# EasyEDA Pro project medulla_2026-05-03.epro

# Schematic Schematic1
Board Name: Board1; Create Date: 2025-12-13; Page Name: P1; Project Name: Kart Medulla (expander for ESP 32); Schematic Name: Schematic1; Update Date: 2026-05-03; Company: EasyEDA.com; Page Size: A4; Version: V1.0
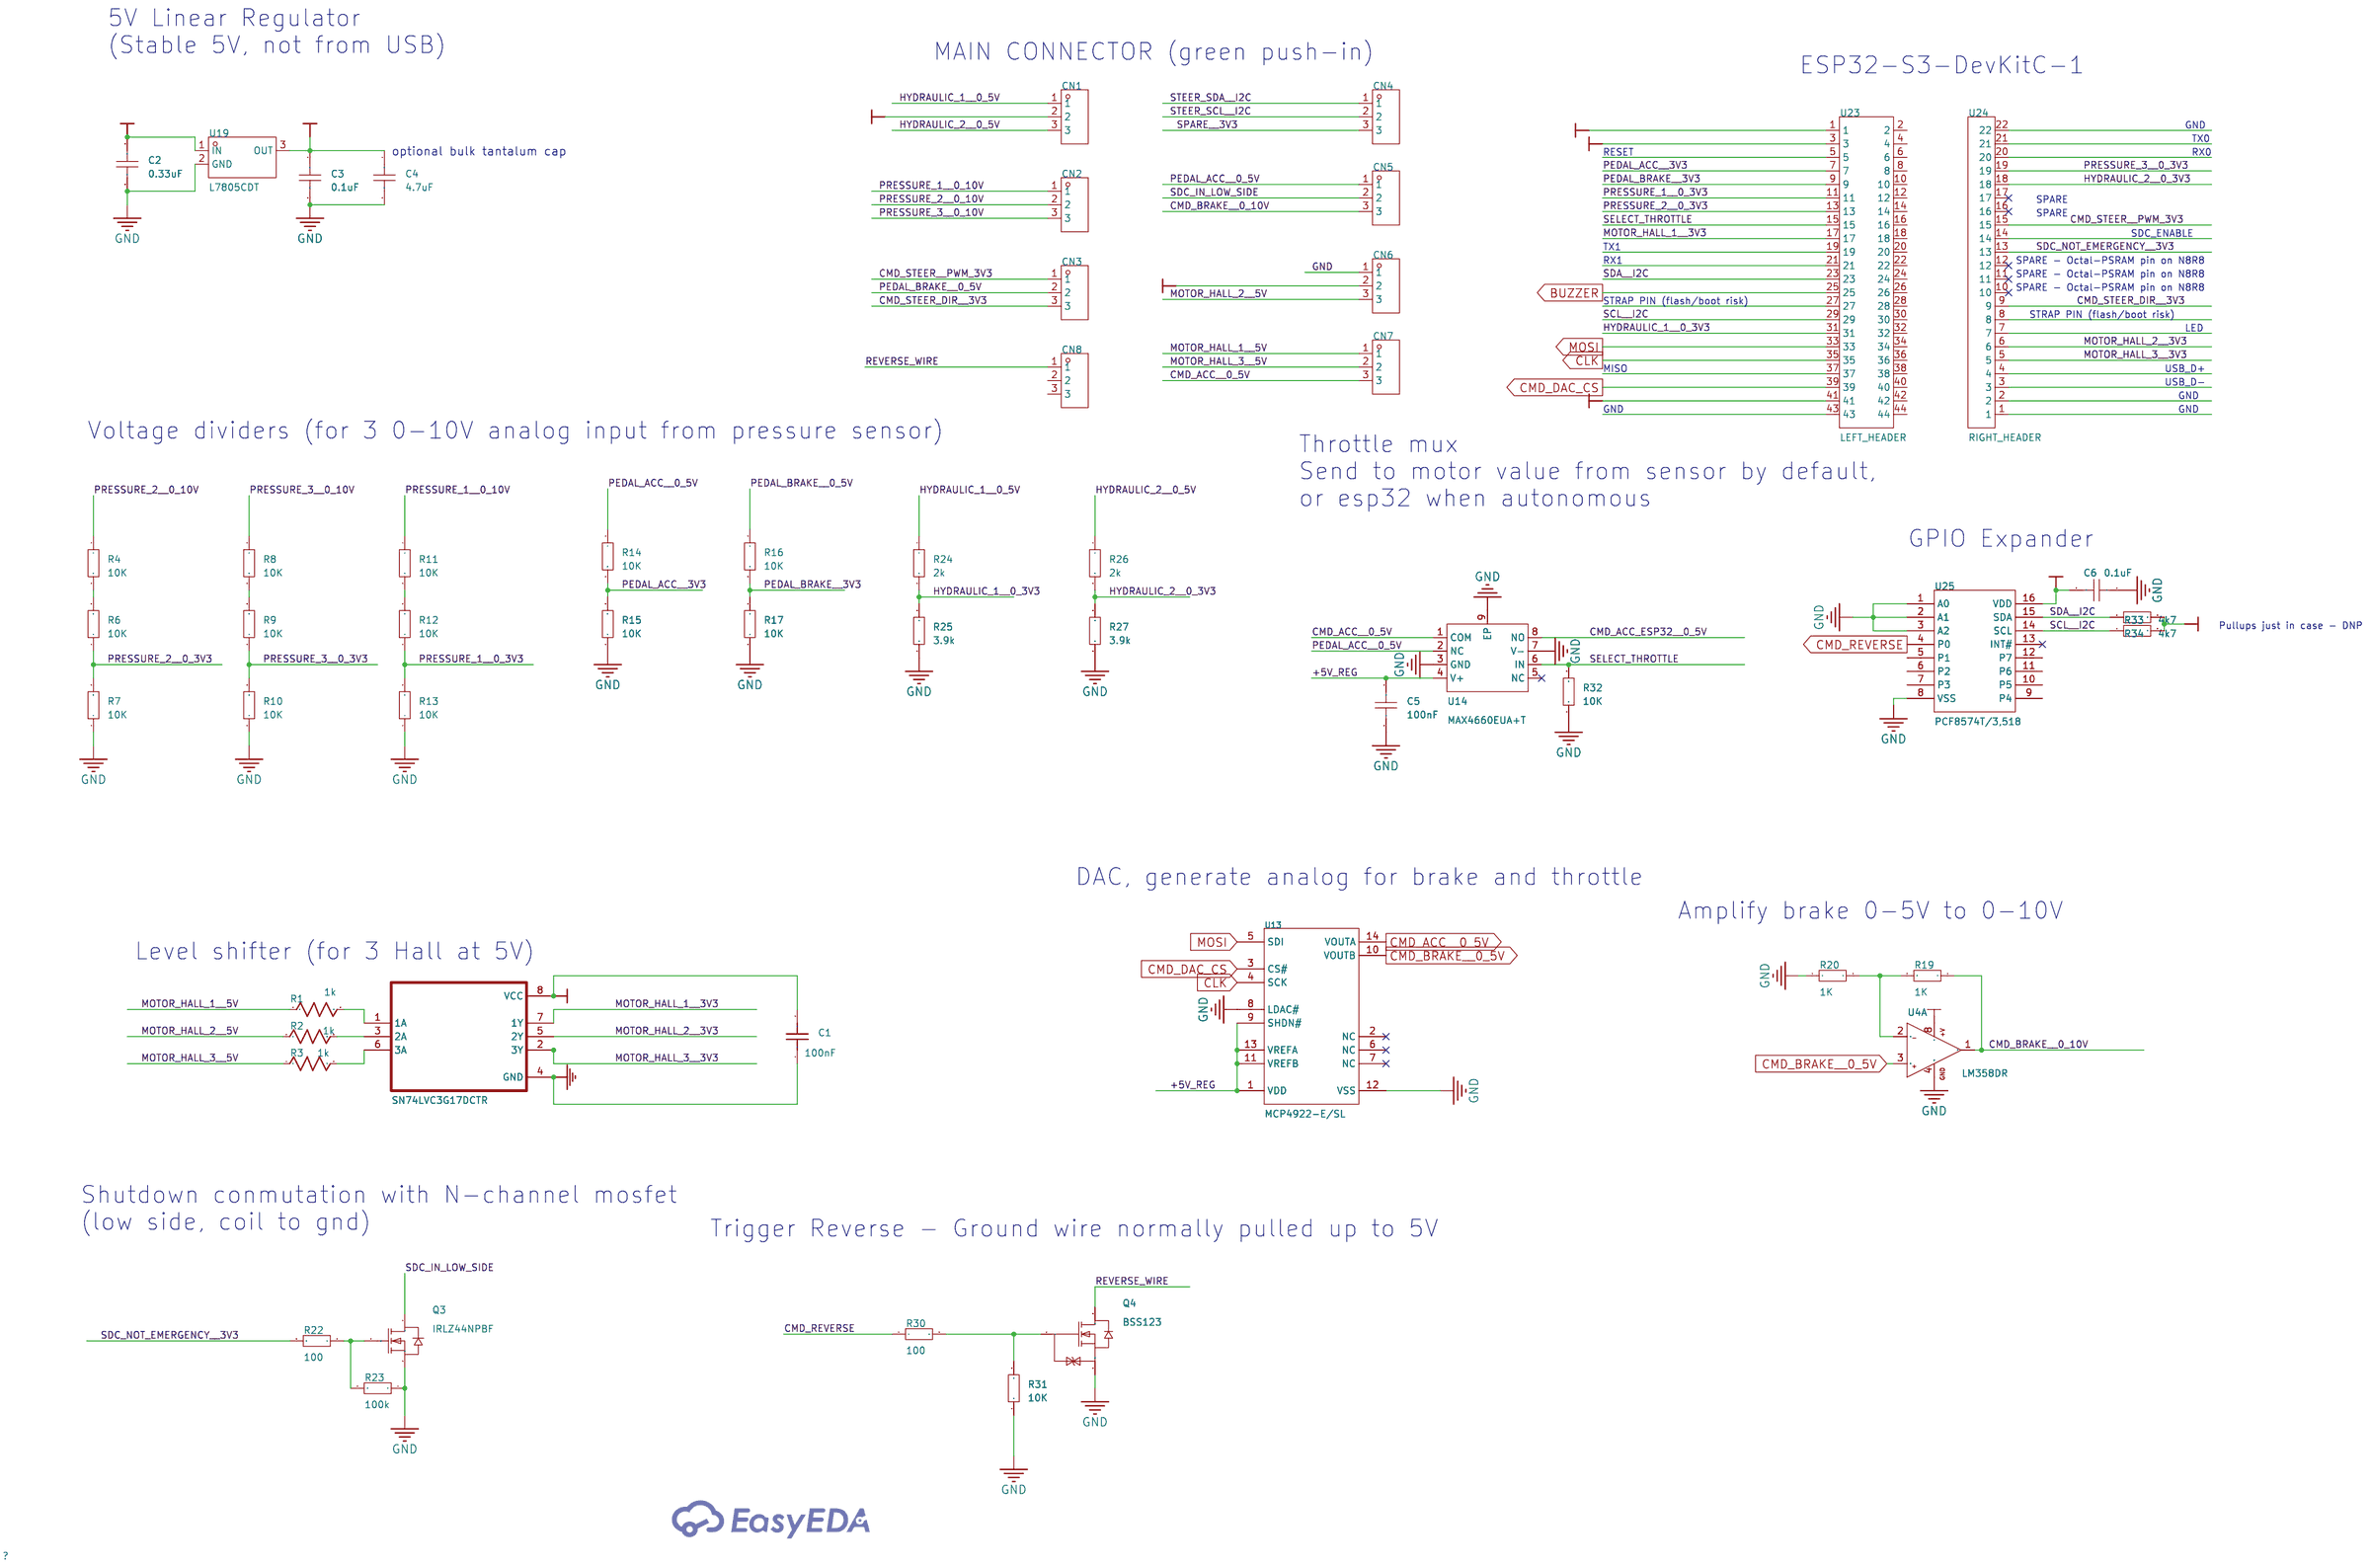
[diagram p0: schematic sheet]

## Parts
C1  100nF  [C0603]
C2  0.33uF  [C0603]
C3  0.1uF  [C0603]
C4  4.7uF  [C0603]
C5  100nF  [C0603]
C6  0.1uF  [C0603]
CN1  1990012  [CONN-TH_3P-P2.50-S5.00_1990012]
CN2  1990012  [CONN-TH_3P-P2.50-S5.00_1990012]
CN3  1990012  [CONN-TH_3P-P2.50-S5.00_1990012]
CN4  1990012  [CONN-TH_3P-P2.50-S5.00_1990012]
CN5  1990012  [CONN-TH_3P-P2.50-S5.00_1990012]
CN6  1990012  [CONN-TH_3P-P2.50-S5.00_1990012]
CN7  1990012  [CONN-TH_3P-P2.50-S5.00_1990012]
CN8  1990012  [CONN-TH_3P-P2.50-S5.00_1990012]
Q3  IRLZ44NPBF  [TO-220-3_L10.0-W4.5-P2.54-T]
Q4  BSS123  [SOT-23_L2.9-W1.3-P1.90-LS2.4-BR]
R1  1k  [R0603]
R2  1k  [R0603]
R3  1k  [R0603]
R4  10K  [R0603]
R6  10K  [R0603]
R7  10K  [R0603]
R8  10K  [R0603]
R9  10K  [R0603]
R10  10K  [R0603]
R11  10K  [R0603]
R12  10K  [R0603]
R13  10K  [R0603]
R14  10K  [R0603]
R15  10K  [R0603]
R16  10K  [R0603]
R17  10K  [R0603]
R19  1K  [R0603]
R20  1K  [R0603]
R22  100  [R0603]
R23  100k  [R0603]
R24  2k  [R0603]
R25  3.9k  [R0603]
R26  2k  [R0603]
R27  3.9k  [R0603]
R30  100  [R0603]
R31  10K  [R0603]
R32  10K  [R0603]
R33  4k7  [R0603]  (no BOM)
R34  4k7  [R0603]  (no BOM)
U4  LM358DR  [SOIC-8_L5.0-W4.0-P1.27-LS6.0-BL]  (section 1)
U5  SN74LVC3G17DCTR  [SOP65P400X130-8N]
U13  MCP4922-E/SL  [SOIC-14_L8.7-W3.9-P1.27-LS6.0-BL]
U14  MAX4660EUA+T  [UMAX-8_L3.0-W3.0-P0.65-LS4.9-BL-EP]
U19  L7805CDT  [TO-252-2_L6.6-W6.1-P4.57-LS9.9-BR-CW]
U23  LEFT_HEADER  [HDR-TH_ESQ-122-59-G-D]
U24  RIGHT_HEADER  [HDR-TH_ESQ-122-23-G-S]
U25  PCF8574T/3,518  [SOIC-16_L10.3-W7.5-P1.27-LS10.3-BL]

## Library data of the parts
C1 = 100nF: nameAlias: Value(F); Contributor: LCEDA_Lib; spicePre: C; spiceSymbolName: C_0603_US
C2-C6 = CAP_0603: Supplier Footprint: 0603
CN1-CN8 = 1990012: Supplier Part: C9900080101; Supplier Footprint: 3P; Supplier: LCSC
Q3 = IRLZ44NPBF: Type:1 N-Channel Drain Source Voltage (Vdss): Continuous Drain Current (Id): Drain Source On Resistance (RDS(on)@Vgs,Id):0.025Ω@5.0V,25A Power Dissipation (Pd): Gate Threshold Voltage (Vgs(th)@Id):1V@250uA Total Gate Charge (Qg@Vgs):48nC Input Capacitance; LCSC Part Name: 1个N沟道 耐压:55V 电流:47A; Supplier Part: C38774; Manufacturer: Infineon(英飞凌); Supplier Footprint: TO-220AB; JLCPCB Part Class: Extended Part; Datasheet: https://atta.szlcsc.com/upload/public/pdf/source/20141125/1457707250505.pdf; Supplier: LCSC; Type: 1 N-Channel; Drain Source On Resistance (RDS(on)@Vgs,Id): 0.025Ω@5.0V,25A; Gate Threshold Voltage (Vgs(th)@Id): 1V@250uA; Total Gate Charge (Qg@Vgs): 48nC; Input Capacitance (Ciss@Vds): 1.7nF; Reverse Transfer Capacitance (Crss@Vds): 150pF; Operating Temperature: -55℃~+175℃
Q4 = BSS123_C5184436: Number:One N-channel Drain to Source Voltage:100V Current - Continuous Drain(Id):170mA RDS(on):6Ω@10V,0.17A Pd - Power Dissipation:350mW Gate Threshold Voltage (Vgs(th)):2.5V Input Capacitance(Ciss):30pF@50V Reverse Transfer Capacitance (Crss@Vds):7pF@50V; LCSC Part Name: 1个N沟道 耐压:100V 电流:0.17A; Supplier Part: C5184436; Manufacturer: HXY MOSFET(华轩阳电子); Supplier Footprint: SOT-23; JLCPCB Part Class: Extended Part; Datasheet: https://item.szlcsc.com/datasheet/BSS123/5849872.html; Supplier: LCSC; Number: One N-channel; Drain to Source Voltage: 100V; Current - Continuous Drain(Id): 170mA; RDS(on): 6Ω@10V,0.17A; Pd - Power Dissipation: 350mW; Gate Threshold Voltage (Vgs(th)): 2.5V; Input Capacitance(Ciss): 30pF@50V; Reverse Transfer Capacitance (Crss@Vds): 7pF@50V; Operating Temperature: -55℃~+150℃
R1-R3 = 1k: nameAlias: Value(Ω); Contributor: LCEDA_Lib; spicePre: R; spiceSymbolName: R_0603_US
R4 R6-R17 R19 R20 R22-R27 R30-R34 = Res_0603: Supplier Footprint: 0603
U4 = LM358DR: Number of Channels:2 Maximum Power Supply Range (Vdd-Vss):32V Rail to Rail:- Gain Bandwidth Product:700kHz Vos - Input Offset Voltage:3mV Input Offset Voltage Drift(Vos TC):7uV/℃ Slew Rate:300V/ms Ib - Input Bias Current:20nA Input Offset Current(Ios):2nA; LCSC Part Name: 行业标准双路运算放大器; Supplier Part: C5423; Manufacturer: TI(德州仪器); Supplier Footprint: SOIC-8; JLCPCB Part Class: Extended Part; Datasheet: https://www.ti.com/cn/lit/gpn/lm358; Supplier: LCSC; Number of Channels: 2; Maximum Power Supply Range (Vdd-Vss): 32V; Gain Bandwidth Product: 700kHz; Vos - Input Offset Voltage: 3mV; Input Offset Voltage Drift(Vos TC): 7uV/℃; Slew Rate: 300V/ms; Ib - Input Bias Current: 20nA; Input Offset Current(Ios): 2nA; Noise density(eN): 40nV/√Hz@1kHz; Common Mode Rejection Ratio(CMRR): 99dB; Input offset current drift(Ios TC): 10pA/℃; Quiescent Current: 700uA; Output Current: 20mA; Operating Temperature: 0℃~+70℃; Single supply: 3V~32V; Dual Supply: -16V~16V
U5 = SN74LVC3G17DCTR
U13 = MCP4922-E/SL: Resolution(Bits):12 Number of Channels:2 Interface:SPI Voltage - Supply:2.7V~5.5V Voltage - Supply:2.7V~5.5V Settling Time:4.5us Output Type:Voltage Buffer Integral non - linearity:0.2LSB Integral non - linearity:0.2LSB Operating Temperature:-40℃~+125℃ Op; LCSC Part Name: 8/10/12位双电压输出数模转换器，带SPI接口; Supplier Part: C39851; Manufacturer: MICROCHIP(美国微芯); Supplier Footprint: SOIC-14; JLCPCB Part Class: Extended Part; Datasheet: https://item.szlcsc.com/datasheet/MCP4922-E%252FSL/40833.html; Supplier: LCSC; Resolution(Bits): 12; Number of Channels: 2; Interface: SPI; Voltage - Supply: 2.7V~5.5V; Settling Time: 4.5us; Output Type: Voltage Buffer; Integral non - linearity: 0.2LSB; Operating Temperature: -40℃~+125℃; Power-On Reset: Built-in; Voltage Reference: External; Quiescent Current (Iq): 350uA
U14 = MAX4660EUA+T: Switch Circuit:2:1 Number of Channels:1 Voltage - Supply:9V~40V；4.5V~20V；-20V~-4.5V Voltage - Supply:9V~40V；4.5V~20V；-20V~-4.5V Ron:25Ω Operating Temperature:-40℃~+85℃ Operating Temperature:-40℃~+85℃ Con:25pF Bandwidth:225MHz; LCSC Part Name: 大电流、25Ω、SPDT、CMOS模拟开关; Supplier Part: C2673393; Manufacturer: ADI(亚德诺)/MAXIM(美信); Supplier Footprint: UMAX-8-EP; JLCPCB Part Class: Extended Part; Datasheet: https://item.szlcsc.com/datasheet/MAX4660EUA%252BT/2765309.html; Supplier: LCSC; Switch Circuit: 2:1; Number of Channels: 1; Voltage - Supply: 9V~40V；4.5V~20V；-20V~-4.5V; Ron: 25Ω; Operating Temperature: -40℃~+85℃; Con: 25pF; Bandwidth: 225MHz
U19 = L7805CDT_C20611927: Output Type:Fixed Voltage - Supply:35V Output Voltage:5V Output Voltage:5V Output Current:500mA Power Supply Rejection Ratio (PSRR):80dB@(120Hz) Voltage Dropout:2V@(350mA) standby current:4.2mA Noise:40uV Output Configuration:Positive; LCSC Part Name: IO:0.5A VO:5V VI:35V; Supplier Part: C20611927; Manufacturer: HXY MOSFET(华轩阳电子); Supplier Footprint: TO-252-2L; JLCPCB Part Class: Extended Part; Datasheet: https://item.szlcsc.com/datasheet/L7805CDT/21968527.html; Supplier: LCSC; Output Type: Fixed; Voltage - Supply: 35V; Output Voltage: 5V; Output Current: 500mA; Power Supply Rejection Ratio (PSRR): 80dB@(120Hz); Voltage Dropout: 2V@(350mA); standby current: 4.2mA; Noise: 40uV; Output Configuration: Positive
U23 = SSW-122-01-T-D: Holes Structure:2x22P Pitch:2.54mm Row Spacing:2.54mm Mounting Type:Through Hole Number of Rows:2 Number of Positions:44P Current Rating:4.7A Insulation Height:8.51mm Contact Plating:Tin Operating Temperature:-55℃~+105℃ Operating Temperature:-55℃~+105℃; LCSC Part Name: 2x22P 间距:2.54mm 直插; Supplier Part: C7019509; Manufacturer: SAMTEC; Supplier Footprint: 插件,P=2.54mm; JLCPCB Part Class: Extended Part; Datasheet: https://item.szlcsc.com/datasheet/SSW-122-01-T-D/7985850.html; Supplier: LCSC; Holes Structure: 2x22P; Pitch: 2.54mm; Row Spacing: 2.54mm; Mounting Type: Through Hole; Number of Rows: 2; Number of Positions: 44P; Current Rating: 4.7A; Insulation Height: 8.51mm; Contact Plating: Tin; Operating Temperature: -55℃~+105℃
U24 = SSW-122-01-T-S: Pitch:2.54mm Mounting Type:Through Hole Number of Rows:1 Number of Positions:22P Current Rating:4.7A Insulation Height:8.51mm Contact Plating:Tin Operating Temperature:-55℃~+105℃ Operating Temperature:-55℃~+105℃; LCSC Part Name: 间距:2.54mm 直插; Supplier Part: C6302794; Manufacturer: SAMTEC; Supplier Footprint: 插件,P=2.54mm; JLCPCB Part Class: Extended Part; Datasheet: https://item.szlcsc.com/datasheet/SSW-122-01-T-S/7249907.html; Supplier: LCSC; Pitch: 2.54mm; Mounting Type: Through Hole; Number of Rows: 1; Number of Positions: 22P; Current Rating: 4.7A; Insulation Height: 8.51mm; Contact Plating: Tin; Operating Temperature: -55℃~+105℃
U25 = PCF8574T/3,518: Interface:I2C Number of I/O:8 Interrupt Output:With Interrupt Output Output Type:- Voltage - Supply:2.5V~6V Voltage - Supply:2.5V~6V Current - Output Low(IOL):- Current - Output High(IOH):- Clock Frequency:100kHz Operating Temperature:-40℃~+85℃ Operating; LCSC Part Name: I2C总线 远程8位I/O扩展; Supplier Part: C7605; Manufacturer: NXP(恩智浦); Supplier Footprint: SOIC-16-300mil; JLCPCB Part Class: Extended Part; Datasheet: https://www.nxp.com/docs/en/data-sheet/PCF8574_PCF8574A.pdf; Supplier: LCSC; Interface: I2C; Number of I/O: 8; Interrupt Output: With Interrupt Output; Voltage - Supply: 2.5V~6V; Clock Frequency: 100kHz; Operating Temperature: -40℃~+85℃

## Nets
3V3: C1.2 C6.2 CN1.2 R33.2 R34.2 U5.8(VCC) U23.1 U23.3 U25.16(VDD)
12V: C2.1 CN6.2 U4.8(+V) U19.1(IN)
+5V_REG: C3.1 C4.1 C5.1 U13.1(VDD) U13.9(SHDN#) U13.11(VREFB) U13.13(VREFA) U14.4(V+) U19.3(OUT)
+5V_USB: U23.41
GND: C1.1 C2.2 C3.2 C4.2 C5.2 C6.1 CN6.1 Q3.3(S) Q4.2(S) R7.1 R10.1 R13.1 R15.1 R17.1 R20.1 R23.1 R25.1 R27.1 R31.1 R32.1 U4.4(GND) U5.4(GND) U13.8(LDAC#) U13.12(VSS) U14.3(GND) U14.7(V-) U14.9(EP) U19.2(GND) U25.1(A0) U25.2(A1) U25.3(A2) U25.8(VSS)
BUZZER: U23.25
CLK: U13.4(SCK) U23.35
CMD_ACC__0_5V: CN7.3 U13.14(VOUTA) U14.1(COM)
CMD_ACC_ESP32__0_5V: U14.8(NO)
CMD_BRAKE__0_5V: U4.3(+IN1) U13.10(VOUTB)
CMD_BRAKE__0_10V: CN5.3 R19.1 U4.1(OUT1)
CMD_DAC_CS: U13.3(CS#) U23.39
CMD_REVERSE: R30.1 U25.4(P0)
CMD_STEER__PWM_3V3: CN3.1 U24.15
CMD_STEER_DIR__3V3: CN3.3 U24.9
HYDRAULIC_1__0_3V3: R24.2 R25.2 U23.31
HYDRAULIC_1__0_5V: CN1.1 R24.1
HYDRAULIC_2__0_3V3: R26.2 R27.2 U24.18
HYDRAULIC_2__0_5V: CN1.3 R26.1
MOSI: U13.5(SDI) U23.33
MOTOR_HALL_1__3V3: U5.7(1Y) U23.17
MOTOR_HALL_1__5V: CN7.1 R1.1
MOTOR_HALL_2__3V3: U5.5(2Y) U24.6
MOTOR_HALL_2__5V: CN6.3 R2.1
MOTOR_HALL_3__3V3: U5.2(3Y) U24.5
MOTOR_HALL_3__5V: CN7.2 R3.1
PEDAL_ACC__0_5V: CN5.1 R14.1 U14.2(NC)
PEDAL_ACC__3V3: R14.2 R15.2 U23.7
PEDAL_BRAKE__0_5V: CN3.2 R16.1
PEDAL_BRAKE__3V3: R16.2 R17.2 U23.9
PRESSURE_1__0_3V3: R12.1 R13.2 U23.11
PRESSURE_1__0_10V: CN2.1 R11.1
PRESSURE_2__0_3V3: R6.1 R7.2 U23.13
PRESSURE_2__0_10V: CN2.2 R4.1
PRESSURE_3__0_3V3: R9.1 R10.2 U24.19
PRESSURE_3__0_10V: CN2.3 R8.1
REVERSE_WIRE: CN8.1 Q4.3(D)
SCL__I2C: R34.1 U23.29 U25.14(SCL)
SDA__I2C: R33.1 U23.23 U25.15(SDA)
SDC_IN_LOW_SIDE: CN5.2 Q3.2(D)
SDC_NOT_EMERGENCY__3V3: R22.2 U24.13
SELECT_THROTTLE: R32.2 U14.6(IN) U23.15
SPARE__3V3: CN4.3
STEER_SCL__I2C: CN4.2
STEER_SDA__I2C: CN4.1
$1N247: R1.2 U5.1(1A)
$1N249: R2.2 U5.3(2A)
$1N250: R3.2 U5.6(3A)
$1N1811: R4.2 R6.2
$1N18631: R8.2 R9.2
$1N18724: R11.2 R12.2
$1N21883: R19.2 R20.2 U4.2(-IN1)
$1N22832: Q3.1(G) R22.1 R23.2
$1N45076: Q4.1(G) R30.2 R31.2

Not connected (* = marked no-connect by the designer): CN8 2 3; U13 2(NC)* 6(NC)* 7(NC)*; U14 5(NC)*; U23 2 4 5 6 8 10 12 14 16 18 19 20 21 22 24 26 27 28 30 32 34 36 37 38 40 42 43 44; U24 1 2 3 4 7 8 10* 11* 12* 14 16* 17* 20 21 22; U25 5(P1) 6(P2) 7(P3) 9(P4) 10(P5) 11(P6) 12(P7) 13(INT#)*

## Notes on the sheet
- 5V Linear Regulator
  (Stable 5V, not from USB)
- MAIN CONNECTOR (green push-in)
- ESP32-S3-DevKitC-1
- GND
- TX0
- optional bulk tantalum cap
- RESET
- RX0
- SPARE
- SPARE
- SDC_ENABLE
- TX1
- RX1
- SPARE - Octal-PSRAM pin on N8R8
- SPARE - Octal-PSRAM pin on N8R8
- SPARE - Octal-PSRAM pin on N8R8
- STRAP PIN (flash/boot risk)
- STRAP PIN (flash/boot risk)
- LED
- MISO
- USB_D+
- USB_D-
- GND
- GND
- GND
- Voltage dividers (for 3 0-10V analog input from pressure sensor)
- Throttle mux
  Send to motor value from sensor by default,
  or esp32 when autonomous
- GPIO Expander
- Pullups just in case - DNP
- DAC, generate analog for brake and throttle
- Amplify brake 0-5V to 0-10V
- Level shifter (for 3 Hall at 5V)
- Shutdown conmutation with N-channel mosfet
  (low side, coil to gnd)
- Trigger Reverse - Ground wire normally pulled up to 5V

# Board PCB1
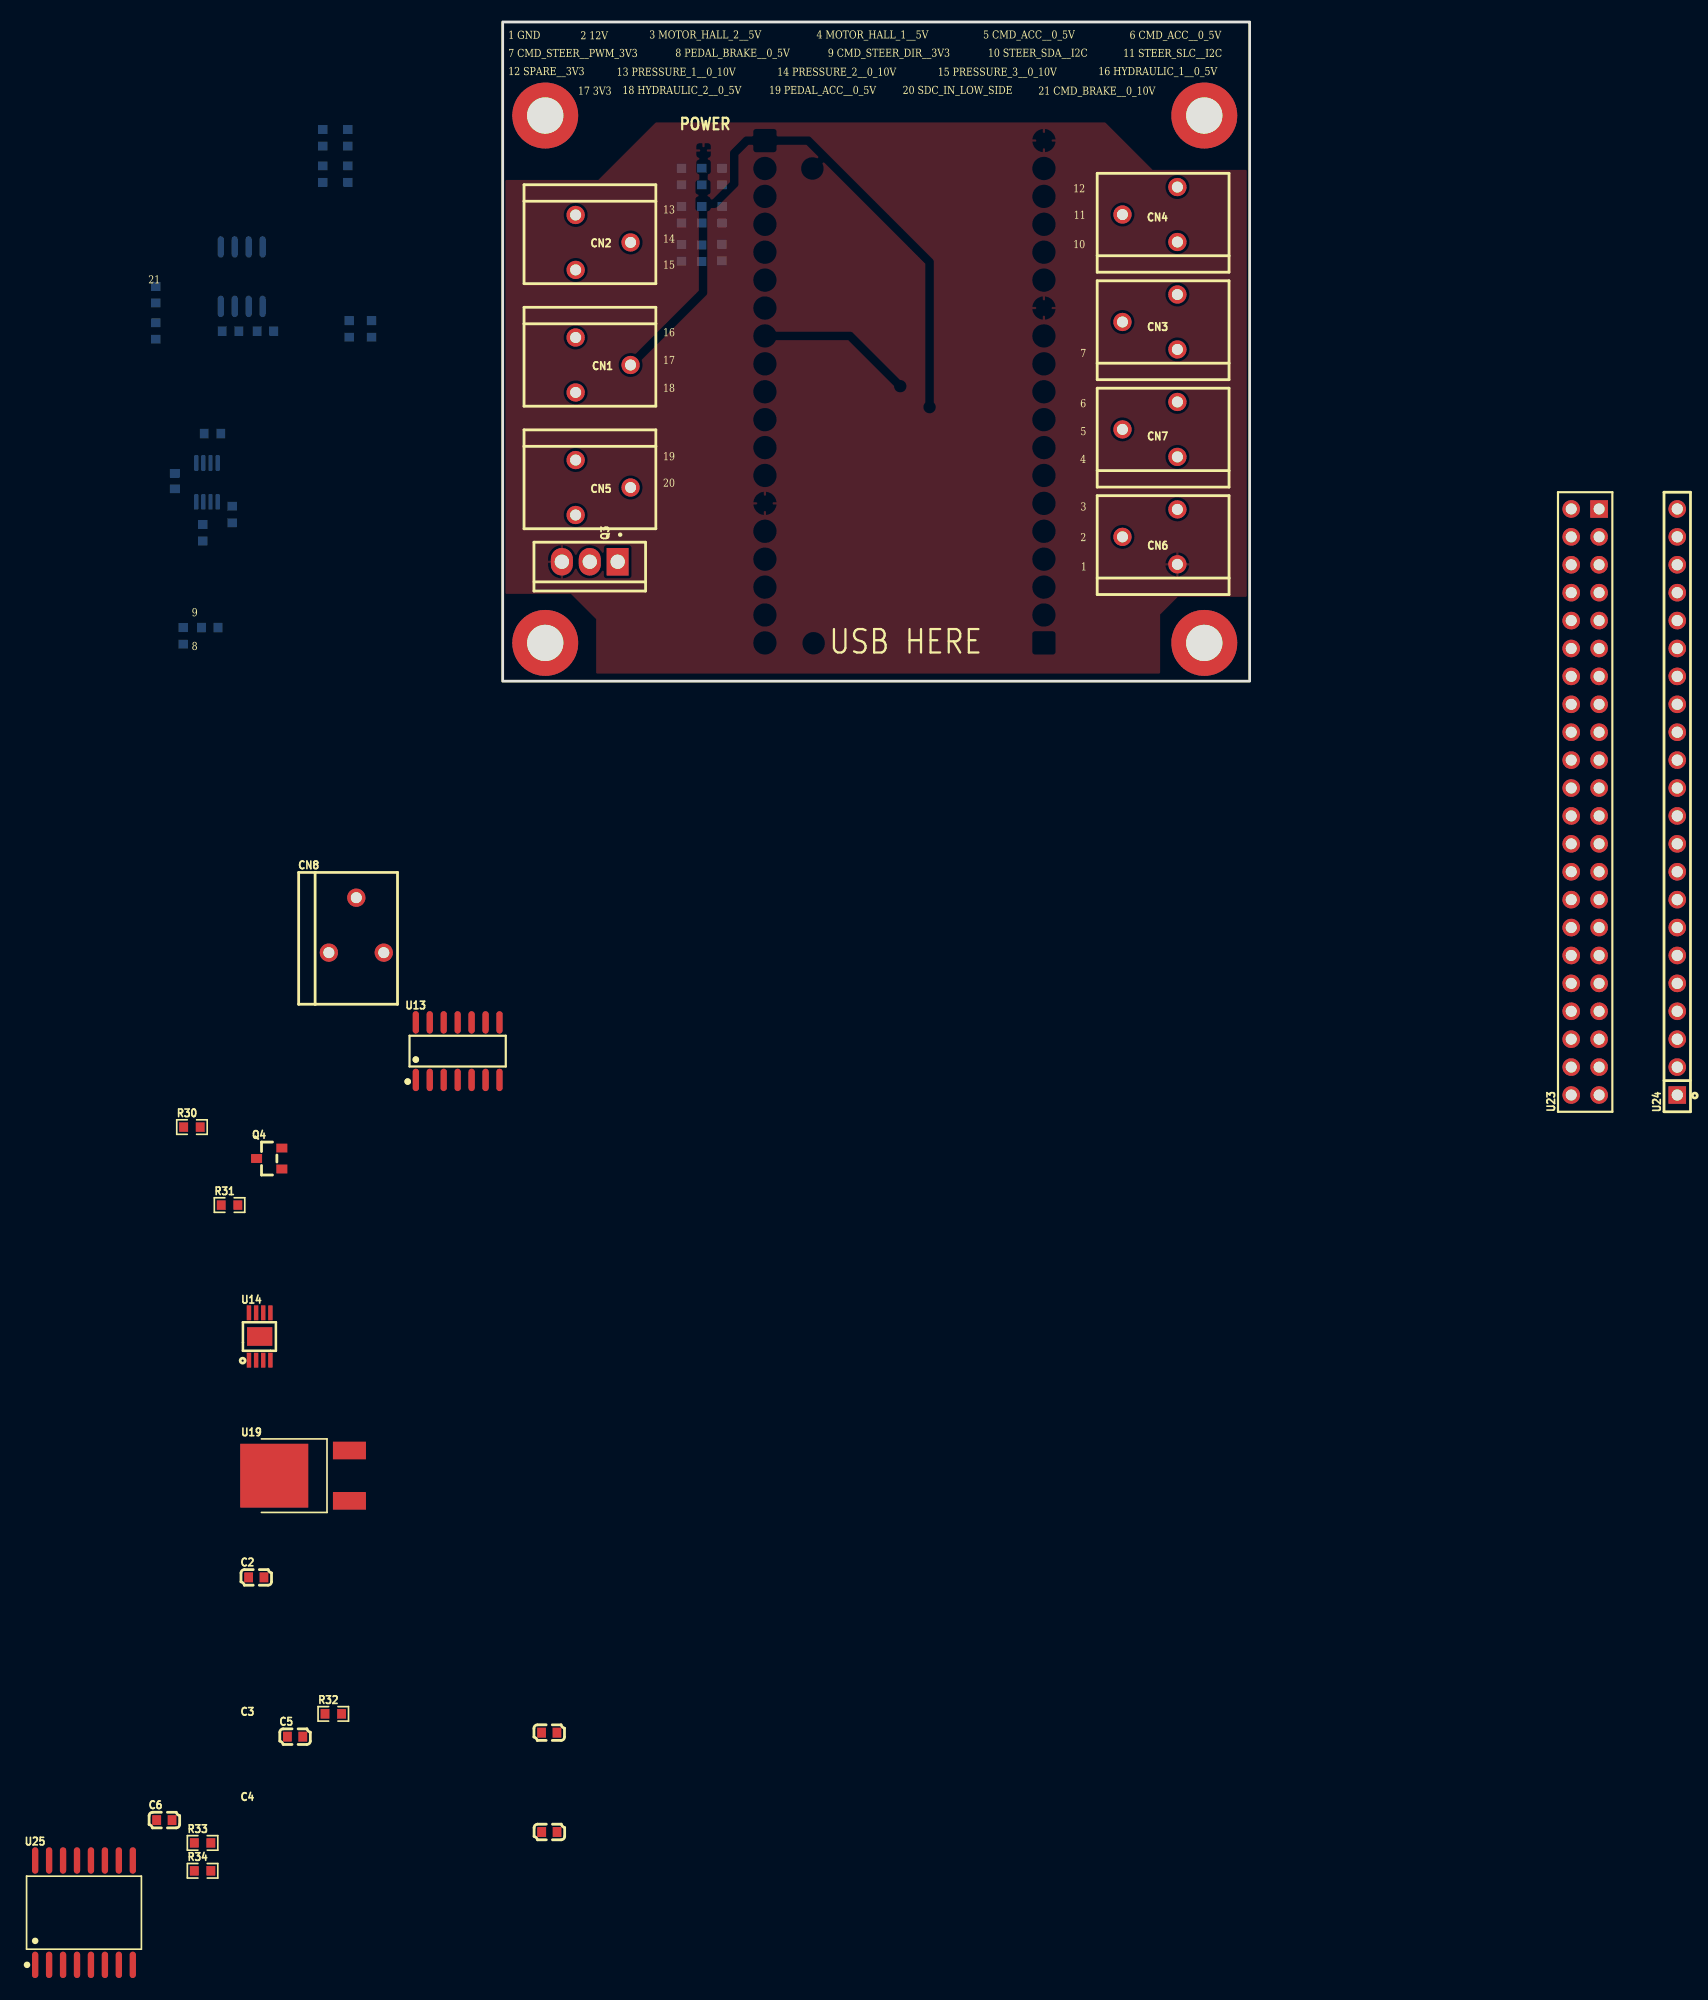
[diagram p1: board, top side]
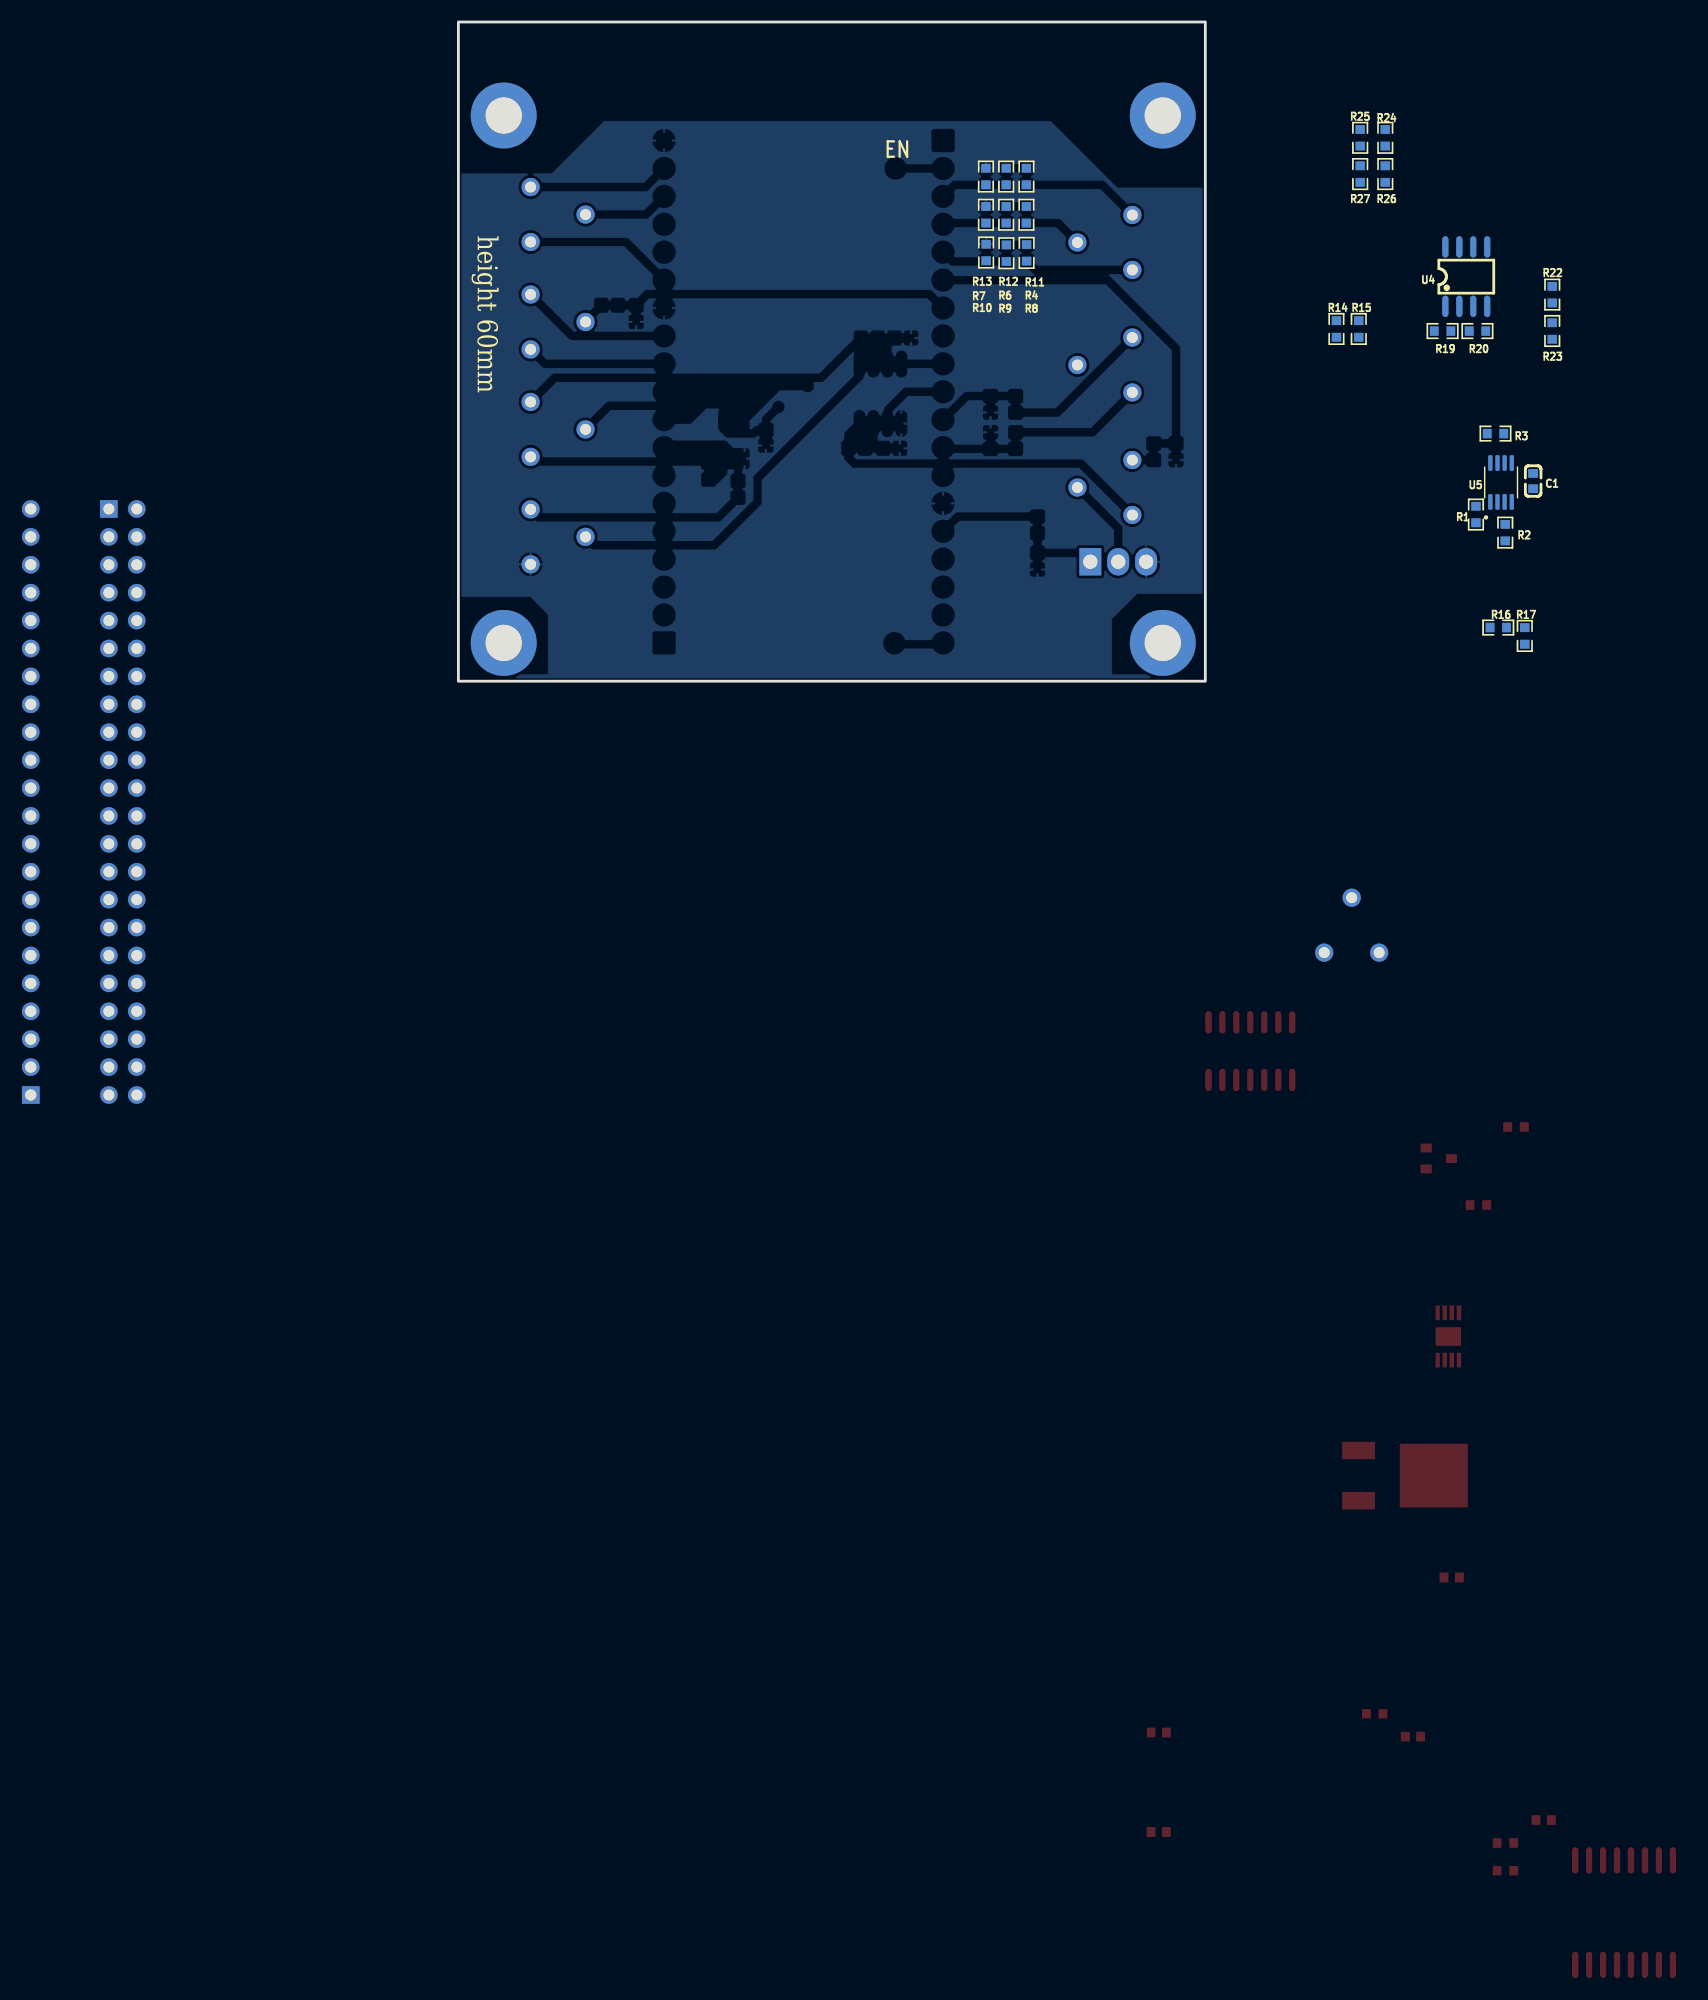
[diagram p2: board, bottom side, seen from below]

Outline 68 x 60 mm; copper layers: Top Layer, Bottom Layer. Coordinates in mm from the lower left corner of the outline.
Outline path: rectangle 0,60 68,0
Stack: Top Layer 0.035mm / Dielectric1 1.51mm FR4 er 4.5 / Bottom Layer 0.035mm

## Design rules (mm)
template: JLCPCB Capability(Two Layers Board)
spacing copperThickness1oz (default): track to track 0.102, other pairs 0.152 to 0.3
spacing copperThickness2oz: track to track 0.203, other pairs 0.152 to 0.3
track width copperThickness1oz (default): min 0.127, default 0.254, max 2.54
track width copperThickness2oz: min 0.203, default 0.254, max 2.54
differential pair differentialPair (default): width min 0.127, default 0.254, max 2.54; gap min 0.152, default 0.152
via viaSize (default): diameter min 0.5, default 0.61, max 10; hole min 0.3, default 0.305, max 6.3

## Placement (name value [footprint] x y rotation side)
C1  100nF  [C0603]  -29.84 18.22 90 bottom
C2  0.33uF  [C0603]  -22.43 -81.57 0 top
C3  0.1uF  [C0603]  4.24 -95.7 0 top
C4  4.7uF  [C0603]  4.25 -104.74 0 top
C5  100nF  [C0603]  -18.9 -96.06 0 top
C6  0.1uF  [C0603]  -30.8 -103.66 0 top
CN1  1990012  [CONN-TH_3P-P2.50-S5.00_1990012]  9.14 28.78 270 top
CN2  1990012  [CONN-TH_3P-P2.50-S5.00_1990012]  9.14 39.93 270 top
CN3  1990012  [CONN-TH_3P-P2.50-S5.00_1990012]  58.93 32.7 90 top
CN4  1990012  [CONN-TH_3P-P2.50-S5.00_1990012]  58.93 42.47 90 top
CN5  1990012  [CONN-TH_3P-P2.50-S5.00_1990012]  9.14 17.63 270 top
CN6  1990012  [CONN-TH_3P-P2.50-S5.00_1990012]  58.93 13.14 90 top
CN7  1990012  [CONN-TH_3P-P2.50-S5.00_1990012]  58.93 22.92 90 top
CN8  1990012  [CONN-TH_3P-P2.50-S5.00_1990012]  -13.32 -22.2 0 top
NOREF  -  [Pad_e1420]  63.88 3.49 0 top
NOREF#2  -  [Pad_e1422]  63.88 51.49 0 top
NOREF#3  -  [Pad_e1413]  3.88 3.49 0 top
NOREF#4  -  [Pad_e1421]  3.88 51.49 0 top
Q3  IRLZ44NPBF  [TO-220-3_L10.0-W4.5-P2.54-T]  7.93 10.87 270 top
Q4  BSS123  [SOT-23_L2.9-W1.3-P1.90-LS2.4-BR]  -21.25 -43.44 0 top
R1  1k  [R0603]  -24.64 15.17 270 bottom
R2  1k  [R0603]  -27.3 13.52 90 bottom
R3  1k  [R0603]  -26.42 22.54 180 bottom
R4  10K  [R0603]  16.29 42.46 90 bottom
R6  10K  [R0603]  18.13 42.46 90 bottom
R7  10K  [R0603]  19.97 42.46 270 bottom
R8  10K  [R0603]  16.27 38.99 90 bottom
R9  10K  [R0603]  18.11 38.95 90 bottom
R10  10K  [R0603]  19.96 39.02 270 bottom
R11  10K  [R0603]  16.29 45.93 90 bottom
R12  10K  [R0603]  18.13 45.93 90 bottom
R13  10K  [R0603]  19.97 45.93 270 bottom
R14  10K  [R0603]  -11.94 32.06 90 bottom
R15  10K  [R0603]  -13.97 32.06 90 bottom
R16  10K  [R0603]  -26.67 4.88 180 bottom
R17  10K  [R0603]  -29.08 4.12 90 bottom
R19  1K  [R0603]  -21.6 31.87 180 bottom
R20  1K  [R0603]  -24.77 31.87 0 bottom
R22  100  [R0603]  -31.58 35.18 90 bottom
R23  100k  [R0603]  -31.58 31.88 90 bottom
R24  2k  [R0603]  -16.38 49.46 90 bottom
R25  3.9k  [R0603]  -14.1 49.46 90 bottom
R26  2k  [R0603]  -16.38 46.16 270 bottom
R27  3.9k  [R0603]  -14.1 46.16 270 bottom
R30  100  [R0603]  -28.29 -40.58 0 top
R31  10K  [R0603]  -24.86 -47.68 0 top
R32  10K  [R0603]  -15.42 -93.99 0 top
R33  4k7  [R0603]  -27.32 -105.73 0 top
R34  4k7  [R0603]  -27.32 -108.27 0 top
U4  LM358DR  [SOIC-8_L5.0-W4.0-P1.27-LS6.0-BL]  -23.76 36.82 180 bottom
U5  SN74LVC3G17DCTR  [SOP65P400X130-8N]  -26.92 18.09 90 bottom
U13  MCP4922-E/SL  [SOIC-14_L8.7-W3.9-P1.27-LS6.0-BL]  -4.1 -33.67 0 top
U14  MAX4660EUA+T  [UMAX-8_L3.0-W3.0-P0.65-LS4.9-BL-EP]  -22.12 -59.64 0 top
U19  L7805CDT  [TO-252-2_L6.6-W6.1-P4.57-LS9.9-BR-CW]  -17.38 -72.31 0 top
U23  LEFT_HEADER  [HDR-TH_ESQ-122-59-G-D]  98.55 -10.99 90 top
U24  RIGHT_HEADER  [HDR-TH_ESQ-122-23-G-S]  106.93 -10.99 90 top
U25  PCF8574T/3,518  [SOIC-16_L10.3-W7.5-P1.27-LS10.3-BL]  -38.12 -112.08 0 top

## Footprints (pads in the part's own frame, mm; a bottom-side part is the same pattern mirrored in y, then rotated)
C0603
  rect 0.8x0.9 smd: 1(-0.7,0) 2(0.7,0)
CONN-TH_3P-P2.50-S5.00_1990012
  round 1.66 hole 1: 1(-2.5,-2.5) 2(0,2.5) 3(2.5,-2.5)
HDR-TH_ESQ-122-23-G-S
  rect 1.6x1.6 hole 1.02: 1(-26.67,0)
  round 1.6 hole 1.02: 2(-24.13,0) 3(-21.59,0) 4(-19.05,0) 5(-16.51,0) 6(-13.97,0) 7(-11.43,0) 8(-8.89,0) 9(-6.35,0) 10(-3.81,0) 11(-1.27,0) 12(1.27,0) 13(3.81,0) 14(6.35,0) 15(8.89,0) 16(11.43,0) 17(13.97,0) 18(16.51,0) 19(19.05,0) 20(21.59,0) 21(24.13,0) 22(26.67,0)
HDR-TH_ESQ-122-59-G-D
  rect 1.6x1.6 hole 1: 1(26.67,-1.27)
  round 1.6 hole 1: 2(26.67,1.27) 3(24.13,-1.27) 4(24.13,1.27) 5(21.59,-1.27) 6(21.59,1.27) 7(19.05,-1.27) 8(19.05,1.27) 9(16.511,-1.27) 10(16.51,1.27) 11(13.97,-1.27) 12(13.97,1.27) 13(11.43,-1.27) 14(11.43,1.27) 15(8.89,-1.27) 16(8.89,1.27) 17(6.35,-1.27) 18(6.35,1.27) 19(3.81,-1.27) 20(3.81,1.27) 21(1.27,-1.27) 22(1.27,1.27) 23(-1.27,-1.27) 24(-1.27,1.27) 25(-3.81,-1.27) 26(-3.81,1.27) 27(-6.35,-1.27) 28(-6.35,1.27) 29(-8.89,-1.27) 30(-8.89,1.27) 31(-11.43,-1.27) 32(-11.43,1.27) 33(-13.97,-1.27) 34(-13.97,1.27) 35(-16.51,-1.27) 36(-16.51,1.27) 37(-19.05,-1.27) 38(-19.05,1.27) 39(-21.59,-1.27) 40(-21.59,1.27) 41(-24.13,-1.27) 42(-24.13,1.27) 43(-26.67,-1.27) 44(-26.67,1.27)
Pad_e1413
  round 6 hole 3.3: 1(0,0)
Pad_e1420
  round 6 hole 3.3: 1(0,0)
Pad_e1421
  round 6 hole 3.3: 1(0,0)
Pad_e1422
  round 6 hole 3.3: 1(0,0)
R0603
  rect 0.806x0.864 smd: 1(-0.753,0) 2(0.753,0)
SOIC-8_L5.0-W4.0-P1.27-LS6.0-BL
  oval 0.569x1.95 smd: 1(-1.905,-2.705) 2(-0.635,-2.705) 3(0.635,-2.705) 4(1.905,-2.705) 5(1.905,2.705) 6(0.635,2.705) 7(-0.635,2.705) 8(-1.905,2.705)
SOIC-14_L8.7-W3.9-P1.27-LS6.0-BL
  oval 0.574x2.038 smd: 1(-3.81,-2.619) 2(-2.54,-2.619) 3(-1.27,-2.619) 4(0,-2.619) 5(1.27,-2.619) 6(2.54,-2.619) 7(3.81,-2.619) 8(3.81,2.619) 9(2.54,2.619) 10(1.27,2.619) 11(0,2.619) 12(-1.27,2.619) 13(-2.54,2.619) 14(-3.81,2.619)
SOIC-16_L10.3-W7.5-P1.27-LS10.3-BL
  oval 0.574x2.401 smd: 1(-4.445,-4.75) 2(-3.175,-4.75) 3(-1.905,-4.75) 4(-0.635,-4.75) 5(0.635,-4.75) 6(1.905,-4.75) 7(3.175,-4.75) 8(4.445,-4.75) 9(4.445,4.75) 10(3.175,4.75) 11(1.905,4.75) 12(0.635,4.75) 13(-0.635,4.75) 14(-1.905,4.75) 15(-3.175,4.75) 16(-4.445,4.75)
SOP65P400X130-8N
  rrect 1.42x0.4 smd: 1(-1.77,0.975) 2(-1.77,0.325) 3(-1.77,-0.325) 4(-1.77,-0.975) 5(1.77,-0.975) 6(1.77,-0.325) 7(1.77,0.325) 8(1.77,0.975)
SOT-23_L2.9-W1.3-P1.90-LS2.4-BR
  rect 1x0.8 smd: 1(1.15,-0.95) 2(1.15,0.95) 3(-1.15,0)
TO-220-3_L10.0-W4.5-P2.54-T
  rect 2.5x2 hole 1.3: 1(0,2.54)
  oval 2.5x2 hole 1.3: 2(0,0) 3(0,-2.54)
TO-252-2_L6.6-W6.1-P4.57-LS9.9-BR-CW
  rect 3x1.6 smd: 1(3.424,-2.29) 3(3.424,2.29)
  rect 6.2x5.8 smd: 2(-3.424,0)
UMAX-8_L3.0-W3.0-P0.65-LS4.9-BL-EP
  rect 0.4x1.349 smd: 1(-0.975,-2.15) 2(-0.325,-2.151) 3(0.325,-2.151) 4(0.976,-2.152) 5(0.976,2.149) 6(0.324,2.151) 7(-0.324,2.15) 8(-0.976,2.152)
  rect 2.3x1.7 smd: 9(0,0)

## Nets
As in the schematic.

Pads without a net: CN8 2 3; NOREF 1; NOREF#2 1; NOREF#3 1; NOREF#4 1; U4 5 6 7; U13 2 6 7; U14 5; U23 2 4 6 8 10 12 14 16 18 20 22 24 26 28 30 32 34 36 38 40 42 44; U24 10 11 12 16 17; U25 5 6 7 9 10 11 12 13

## Copper pours and planes (outline as drawn; the poured copper is in the pictures)
GND on Top Layer: -9.14,50.86 68.96,50.86 68.96,0.69 -9.14,0.69
GND on Bottom Layer: -2.92,50.98 80.65,50.98 80.65,0.06 -2.92,0.06

## Text on the board
Bottom Silkscreen Layer: EN | height 60mm
Top Silkscreen Layer: POWER | USB HERE | 21 | 8 | 9 | 1 GND | 7 CMD_STEER__PWM_3V3 | 12 SPARE__3V3 | 17 3V3 | 2 12V | 13 PRESSURE_1__0_10V | 18 HYDRAULIC_2__0_5V | 3 MOTOR_HALL_2__5V | 13 | 14 | 15 | 16 | 17 | 18 | 19 | 20 | 8 PEDAL_BRAKE__0_5V | 19 PEDAL_ACC__0_5V | 14 PRESSURE_2__0_10V | 4 MOTOR_HALL_1__5V | 9 CMD_STEER_DIR__3V3 | 20 SDC_IN_LOW_SIDE | 15 PRESSURE_3__0_10V | 5 CMD_ACC__0_5V | 10 STEER_SDA__I2C | 21 CMD_BRAKE__0_10V | 12 | 10 | 11 | 4 | 6 | 7 | 2 | 5 | 3 | 1 | 16 HYDRAULIC_1__0_5V | 11 STEER_SLC__I2C | 6 CMD_ACC__0_5V
